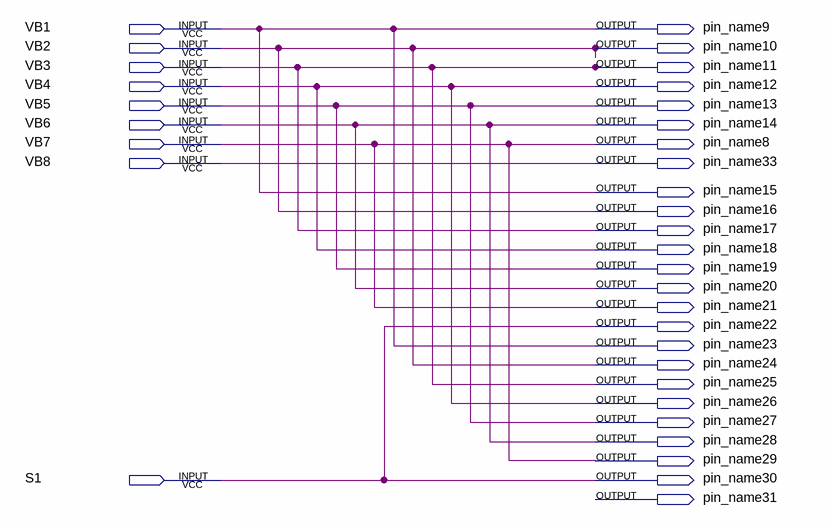
[diagram p0: schematic sheet]
// Quartus schematic cb3.bdf as structural Verilog: 0 symbols, 34 pins
module cb3 (
  input  VB1,
  input  VB2,
  input  VB3,
  input  VB4,
  input  VB5,
  input  VB6,
  input  VB7,
  input  VB8,
  input  S1,
  output pin_name9,
  output pin_name10,
  output pin_name11,
  output pin_name12,
  output pin_name13,
  output pin_name14,
  output pin_name8,
  output pin_name33,
  output pin_name15,
  output pin_name16,
  output pin_name17,
  output pin_name18,
  output pin_name19,
  output pin_name20,
  output pin_name21,
  output pin_name22,
  output pin_name23,
  output pin_name24,
  output pin_name25,
  output pin_name26,
  output pin_name27,
  output pin_name28,
  output pin_name29,
  output pin_name30,
  output pin_name31
);


  assign pin_name8 = VB7;
  assign pin_name9 = VB1;
  assign pin_name10 = VB2;
  assign pin_name11 = VB3;
  assign pin_name12 = VB4;
  assign pin_name13 = VB5;
  assign pin_name14 = VB6;
  assign pin_name15 = VB1;
  assign pin_name16 = VB2;
  assign pin_name17 = VB3;
  assign pin_name18 = VB4;
  assign pin_name19 = VB5;
  assign pin_name20 = VB6;
  assign pin_name21 = VB7;
  assign pin_name22 = S1;
  assign pin_name23 = VB1;
  assign pin_name24 = VB2;
  assign pin_name25 = VB3;
  assign pin_name26 = VB4;
  assign pin_name27 = VB5;
  assign pin_name28 = VB6;
  assign pin_name29 = VB7;
  assign pin_name30 = S1;
  assign pin_name33 = VB8;
endmodule
